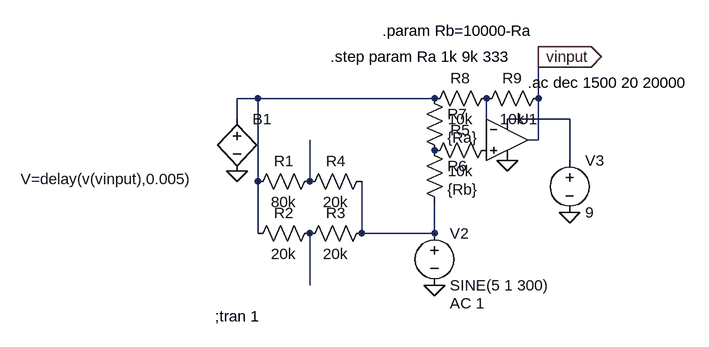
[diagram p0: schematic flangetest.asc]
flangetest.asc, the LTspice schematic file:
Version 4
SHEET 1 880 680
WIRE 368 -64 368 -80
WIRE -64 0 -96 0
WIRE 208 0 -64 0
WIRE 368 0 368 -64
WIRE -96 32 -96 0
WIRE 416 32 320 32
WIRE 288 48 288 0
WIRE 368 64 368 0
WIRE 368 64 352 64
WIRE 416 96 416 32
WIRE -64 128 -64 0
WIRE 16 128 16 64
WIRE -64 208 -64 128
WIRE 96 208 96 128
WIRE 208 208 208 160
WIRE 208 208 96 208
WIRE 16 288 16 208
FLAG 208 288 0
FLAG 368 -64 vinput
IOPIN 368 -64 Out
FLAG -96 112 0
FLAG 416 176 0
FLAG 320 96 0
SYMBOL voltage 208 192 R0
WINDOW 123 24 124 Left 2
WINDOW 39 0 0 Left 0
SYMATTR InstName V2
SYMATTR Value SINE(5 1 300)
SYMATTR Value2 AC 1
SYMBOL bv -96 16 R0
WINDOW 3 -333 108 Left 2
SYMATTR InstName B1
SYMATTR Value V=delay(v(vinput),0.005)
SYMBOL res 32 192 R90
WINDOW 0 0 56 VBottom 2
WINDOW 3 32 56 VTop 2
SYMATTR InstName R2
SYMATTR Value 20k
SYMBOL res 32 112 R90
WINDOW 0 0 56 VBottom 2
WINDOW 3 32 56 VTop 2
SYMATTR InstName R1
SYMATTR Value 80k
SYMBOL res 112 192 R90
WINDOW 0 0 56 VBottom 2
WINDOW 3 32 56 VTop 2
SYMATTR InstName R3
SYMATTR Value 20k
SYMBOL res 112 112 R90
WINDOW 0 0 56 VBottom 2
WINDOW 3 32 56 VTop 2
SYMATTR InstName R4
SYMATTR Value 20k
SYMBOL voltage 416 80 R0
WINDOW 123 24 124 Left 2
WINDOW 39 0 0 Left 0
SYMATTR InstName V3
SYMATTR Value 9
SYMBOL Opamps\\UniversalOpamp2 320 64 R0
SYMATTR InstName U1
SYMBOL res 304 64 R90
WINDOW 0 0 56 VBottom 2
WINDOW 3 32 56 VTop 2
SYMATTR InstName R5
SYMATTR Value 10k
SYMBOL res 192 64 R0
SYMATTR InstName R6
SYMATTR Value {Rb}
SYMBOL res 192 -16 R0
SYMATTR InstName R7
SYMATTR Value {Ra}
SYMBOL res 304 -16 R90
WINDOW 0 0 56 VBottom 2
WINDOW 3 32 56 VTop 2
SYMATTR InstName R8
SYMATTR Value 10k
SYMBOL res 384 -16 R90
WINDOW 0 0 56 VBottom 2
WINDOW 3 32 56 VTop 2
SYMATTR InstName R9
SYMATTR Value 10k
TEXT -130 336 Left 2 !;tran 1
TEXT 352 -24 Left 2 !.ac dec 1500 20 20000
TEXT 128 -104 Left 2 !.param Rb=10000-Ra
TEXT 48 -64 Left 2 !.step param Ra 1k 9k 333

The netlist it stands for:
* flangetest.asc
V2 N005 0 SINE(5 1 300) AC 1
B1 N001 0 V=delay(v(vinput),0.005)
R2 N006 N001 20k
R1 N004 N001 80k
R3 N005 N006 20k
R4 N005 N004 20k
V3 N002 0 9
XU1 P001 N003 N002 0 vinput level.2 Avol=1Meg GBW=10Meg Slew=10Meg ilimit=25m rail=0 Vos=0 phimargin=45 en=0 enk=0 in=0 ink=0 Rin=500Meg  ; pins IN+ IN- V+ V- OUT
R5 P001 P002 10k
R6 P002 N005 {Rb}
R7 N001 P002 {Ra}
R8 N003 N001 10k
R9 vinput N003 10k
;tran 1
.ac dec 1500 20 20000
.param Rb=10000-Ra
.step param Ra 1k 9k 333
.lib UniversalOpamps2.sub
.backanno
.end